# Altium schematic sheet 555timer_blinker.SchDoc
size A4; SheetNumber: 1; SheetTotal: 1
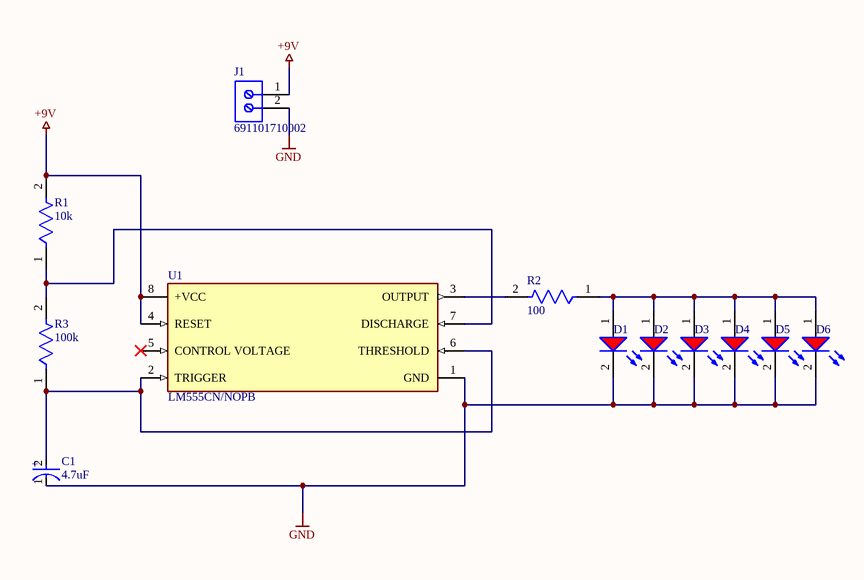
[diagram p0: 555timer_blinker.SchDoc]

## Parts
C1  4.7uF  [FP-RAD-TH-D_5_0_5-L_11_1-MFG]
D1  151051RS11000  [WL-TMRC_D5.9H8.7]  (value not drawn)
D2  151051RS11000  [WL-TMRC_D5.9H8.7]  (value not drawn)
D3  151051RS11000  [WL-TMRC_D5.9H8.7]  (value not drawn)
D4  151051RS11000  [WL-TMRC_D5.9H8.7]  (value not drawn)
D5  151051RS11000  [WL-TMRC_D5.9H8.7]  (value not drawn)
D6  151051RS11000  [WL-TMRC_D5.9H8.7]  (value not drawn)
J1  691101710002  [691101710002]
R1  10k  [FP-MBB0207-MFG]
R2  100  [FP-MBB0207-MFG]
R3  100k  [FP-MBB0207-MFG]
U1  LM555CN/NOPB  [FP-P0008A-MFG]

## Nets
+9V: J1.1 R1.2 U1.4(RESET) U1.8(+VCC)
GND: C1.1(C) D1.2(K) D2.2(K) D3.2(K) D4.2(K) D5.2(K) D6.2(K) J1.2 U1.1(GND)
NetC1_2: C1.2(A) R3.1 U1.2(TRIGGER) U1.6(THRESHOLD)
NetD1_1: D1.1(A) D2.1(A) D3.1(A) D4.1(A) D5.1(A) D6.1(A) R2.1
NetR1_1: R1.1 R3.2 U1.7(DISCHARGE)
NetR2_2: R2.2 U1.3(OUTPUT)

Not connected (* = marked no-connect by the designer): U1 5(CONTROL_VOLTAGE)*

## Notes on the sheet
- (in symbol CMP-05427-000256-1) +

## Library data of the parts
C1 = CMP-05427-000256-1: Aluminum Electrolytic Capacitors (Radial Lead Type) AEC-Q200 Qualified 4.7uF ±20% 50V; Polarity: Polar; Lead Diameter: 0.5mm; Life (Hours): 1000Hour; Impedance: 1.3R; Ripple Current: 95mA; Length: 11mm; Package Quantity: 2000; Voltage Rating (DC): 50V; Max Operating Temperature: 105°C; RoHS Compliant: Yes; Series: FC; Packaging: Ammo Pack; Voltage Rating: 50V; Lead Pitch: 2.5mm; Tolerance: 20%; Capacitance: 4.7uF; Case/Package: Radial; Contact Plating: Tin; Termination: Radial; Height: 11mm; Ratings: AEC-Q200; Radiation Hardening: No; Diameter: 5mm; ESR (Equivalent Series Resistance): 1.3R; Min Operating Temperature: -55°C; Mount: Through Hole; Features: General Purpose; Height - Seated (Max): 0.472inch; Value: 4.7uF
D1-D6 = CMP-1488-00008-2: NexarPartId: 29717813; Lens Style: Circular, Diffused, Round; Lens Size: 5mm; Forward Voltage: 2.1V; Peak Wavelength: 650nm; Forward Current: 100mA; Viewing Angle: 60°; Color: Red; Wavelength: 630nm; Test Current: 20mA; Dominant Wavelength: 645nm; Luminous Intensity: 30mcd; Max Reverse Voltage (DC): 5V; Height: 8.6mm; Length: 5mm; Min Operating Temperature: -40°C; Max Operating Temperature: 85°C; Packaging: Bulk; REACH SVHC: Unknown; Case/Package: Radial; RoHS: Compliant; Width: 5mm; Mount: Through Hole
J1 = CMP-1502-03256-2: NexarPartId: 8917704; Current Rating: 16A; Pitch: 5.0038mm; Stripping Length: -7mm; Plating: Steel; Voltage: 250V; Wire Gauge (Max): 26AWG; Number of Contacts: 2; Number of Levels: 1; Wire Gauge (Min): 14AWG; Number of Pins: 2; Contact Plating: Tin; Max Operating Temperature: 105°C; Contact Material: Brass; Min Operating Temperature: -40°C; Height: 16.4mm; Lead Pitch: 5mm; Length: 9mm; Termination: Screw; Current: 16A; Housing Material: Nylon; Width: 11.2mm; RoHS: Compliant; Voltage Rating: 250V; Number of Positions Per Level: 2; Mount: Through Hole; Color: Blue; Packaging: Box; REACH SVHC: Unknown; Wire/Cable Gauge: 26AWG
R1 = CMP-02408-000035-1: RES 10K OHM 0.6W 1% AXIAL; Voltage Rating: 300V; Resistance: 10kR; Max Power Dissipation: 600mW; Temperature Coefficient: 50ppm/°C; Value: 10kR; Radiation Hardening: No; Case/Package: Conformal; Termination: Axial; Military Standard: Not; Length: 6.5mm; Voltage Rating (DC): 300V; RoHS Compliant: Yes; Number of Terminations: 2; Packaging: Tape and Reel; Features: Automotive AEC-Q200; Tolerance: 1%; Min Operating Temperature: -55°C; Power Rating: 600mW; Lead Free: Lead Free; Resistor Type: Metal Film; Construction: Cylindrical; Series: MBB 0207 - Professional; Max Operating Temperature: 155°C; Diameter: 2.5mm; Resistance Tolerance: 1%; Contact Plating: Tin; Technology: THIN FILM
R2 = CMP-02408-000035-1: RES 10K OHM 0.6W 1% AXIAL; Voltage Rating: 300V; Resistance: 100R; Max Power Dissipation: 600mW; Temperature Coefficient: 50ppm/°C; Value: 100R; Radiation Hardening: No; Case/Package: Conformal; Termination: Axial; Military Standard: Not; Length: 6.5mm; Voltage Rating (DC): 300V; RoHS Compliant: Yes; Number of Terminations: 2; Packaging: Tape and Reel; Features: Automotive AEC-Q200; Tolerance: 1%; Min Operating Temperature: -55°C; Power Rating: 600mW; Lead Free: Lead Free; Resistor Type: Metal Film; Construction: Cylindrical; Series: MBB 0207 - Professional; Max Operating Temperature: 155°C; Diameter: 2.5mm; Resistance Tolerance: 1%; Contact Plating: Tin; Technology: THIN FILM
R3 = CMP-02408-000035-1: RES 10K OHM 0.6W 1% AXIAL; Voltage Rating: 300V; Resistance: 100kR; Max Power Dissipation: 600mW; Temperature Coefficient: 50ppm/°C; Value: 100kR; Radiation Hardening: No; Case/Package: Conformal; Termination: Axial; Military Standard: Not; Length: 6.5mm; Voltage Rating (DC): 300V; RoHS Compliant: Yes; Number of Terminations: 2; Packaging: Tape and Reel; Features: Automotive AEC-Q200; Tolerance: 1%; Min Operating Temperature: -55°C; Power Rating: 600mW; Lead Free: Lead Free; Resistor Type: Metal Film; Construction: Cylindrical; Series: MBB 0207 - Professional; Max Operating Temperature: 155°C; Diameter: 2.5mm; Resistance Tolerance: 1%; Contact Plating: Tin; Technology: THIN FILM
U1 = CMP-0056-00016-4: IC OSC SINGLE TIMER 100KHZ 8-DIP; Manufacturer: Texas Instruments; Min Supply Voltage: 4.5V; Standoff Height: 0.51mm; Number Of Timers/Counters: 1; Max Supply Voltage: 16V; Max Junction Temp: +70°C; Nominal Supply Current: 3mA; ComponentLink2Description: Datasheet; Category: IC; Manufacturer Part Number: LM555CN/NOPB; Digikey Description: IC OSC SINGLE TIMER 100KHZ 8-DIP; Ambient Temperature Range High: +70°C; Automotive: No; Device Class L3: Timers and Oscillators; Device Class L1: Integrated Circuits (ICs); Temperature Range High: +70°C; Lead Free: Yes; ComponentLink2URL: http://www.ti.com/lit/ds/symlink/lm555.pdf; Octopart: https://octopart.com/lm555cn%2Fnopb-texas+instruments-24814897; RoHS: TRUE; Ambient Temperature Range Low: 0°C; Temperature Range Low: 0°C; Package: P0008A; Temperature: 0°C to +70°C; Height: 5.08mm; Device Class L2: Clock and Timing